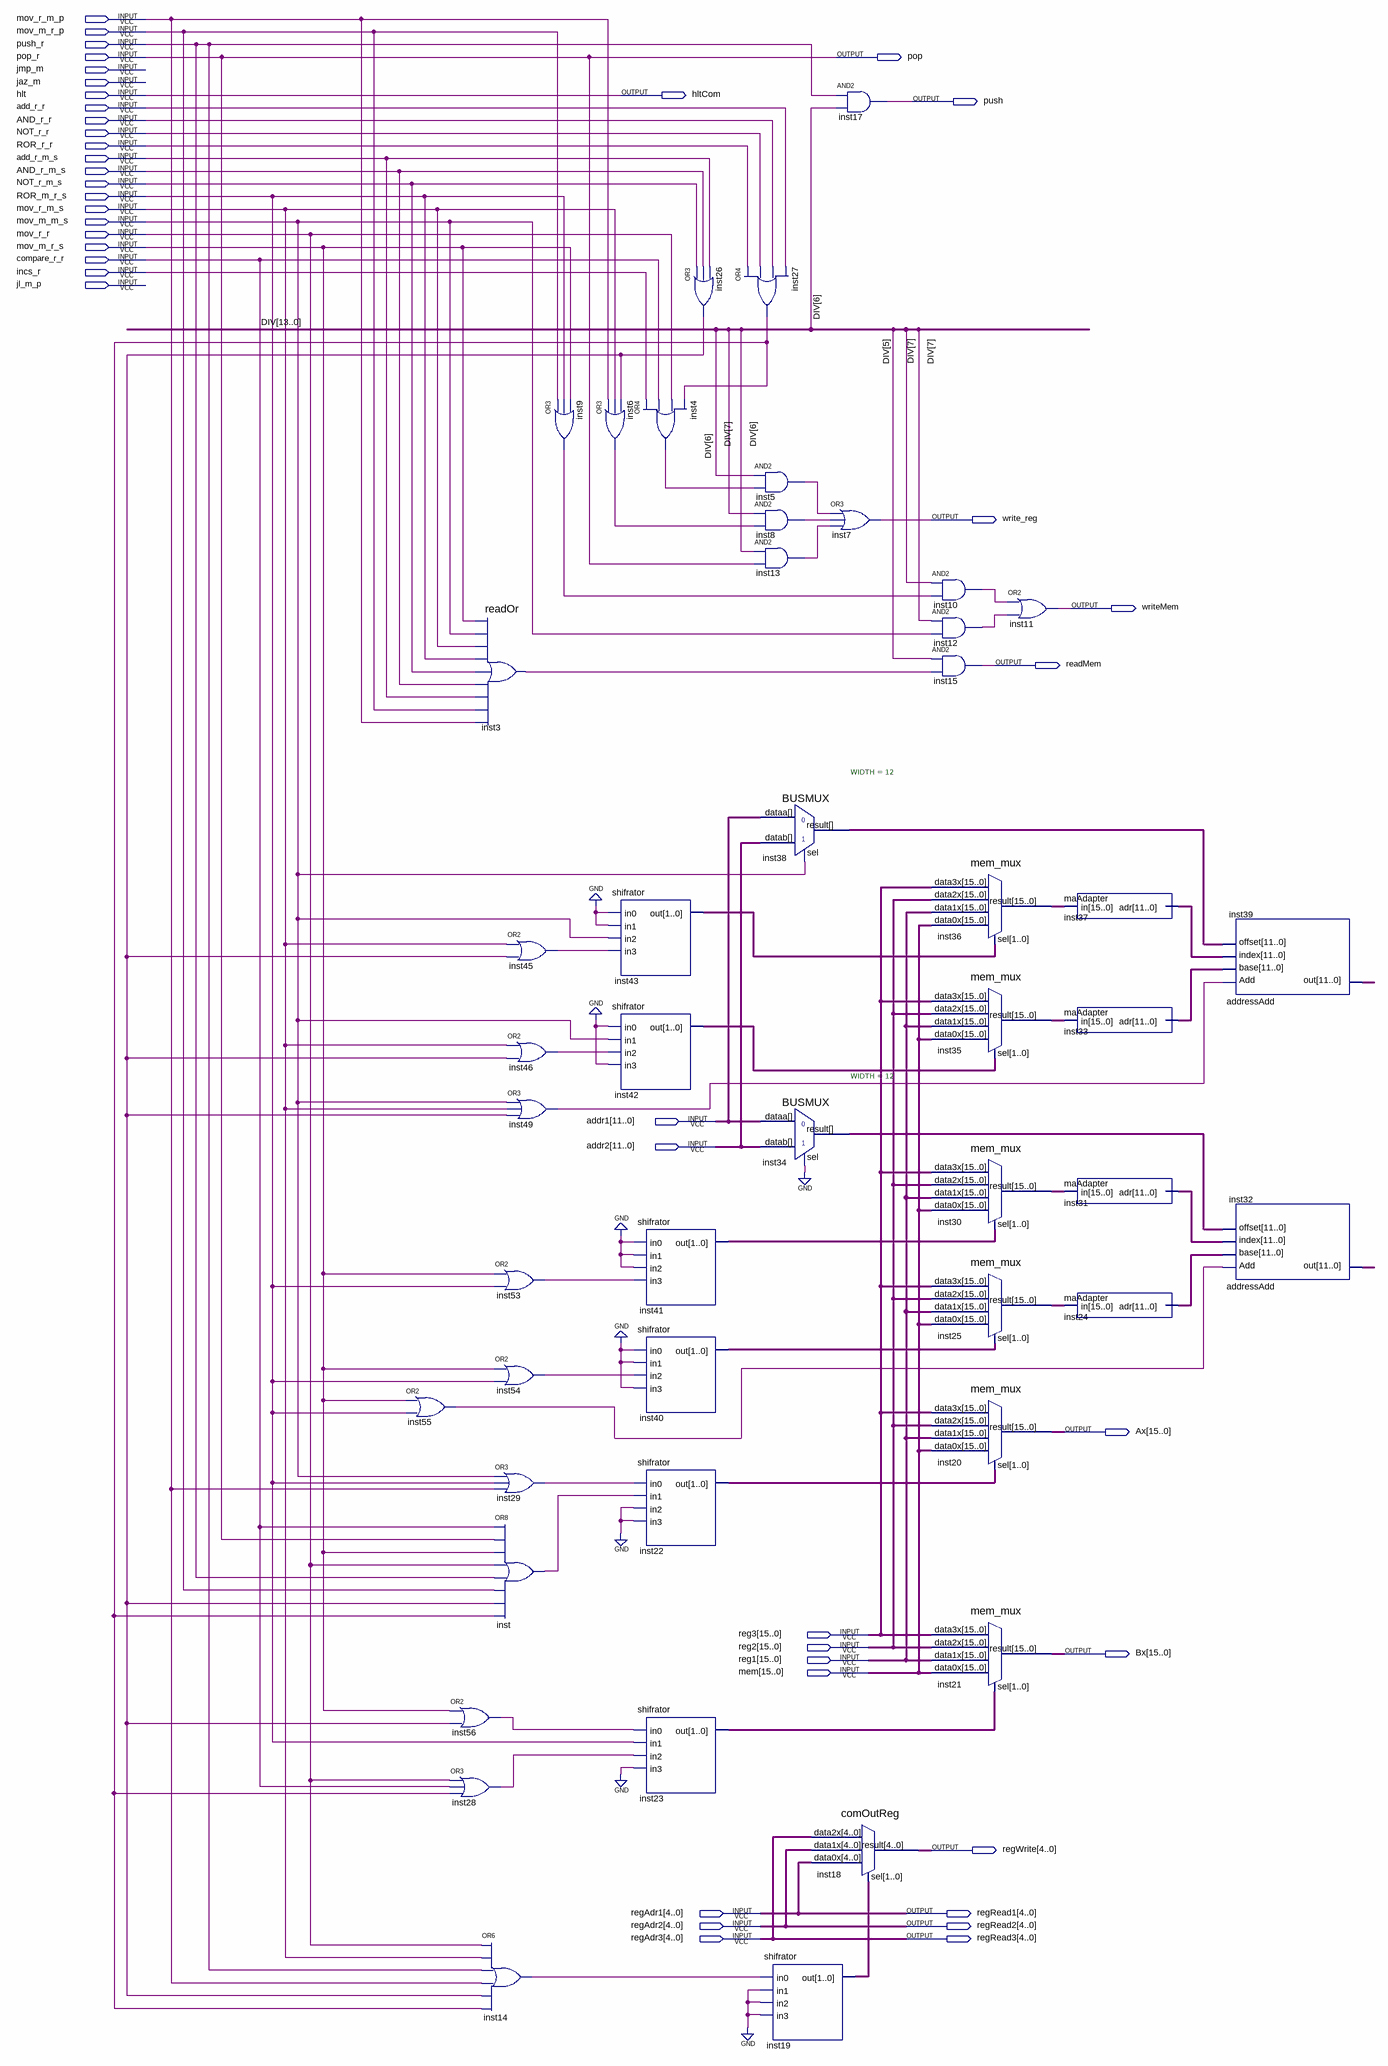
[diagram p0: schematic sheet]
// Quartus schematic CommandX.bdf as structural Verilog: 48 symbols, 43 pins
module CommandX (
  input  mov_r_m_p,
  input  mov_m_r_p,
  input  push_r,
  input  pop_r,
  input  jmp_m,
  input  jaz_m,
  input  hlt,
  input  add_r_r,
  input  AND_r_r,
  input  NOT_r_r,
  input  ROR_r_r,
  input  add_r_m_s,
  input  AND_r_m_s,
  input  NOT_r_m_s,
  input  ROR_m_r_s,
  input  mov_r_m_s,
  input  mov_m_m_s,
  input  mov_r_r,
  input  mov_m_r_s,
  input  compare_r_r,
  input  incs_r,
  input  jl_m_p,
  input  [11:0] addr1,
  input  [11:0] addr2,
  input  [15:0] reg3,
  input  [15:0] reg2,
  input  [15:0] reg1,
  input  [15:0] mem,
  input  [4:0] regAdr1,
  input  [4:0] regAdr2,
  input  [4:0] regAdr3,
  output pop,
  output hltCom,
  output push,
  output write_reg,
  output writeMem,
  output readMem,
  output [15:0] Ax,
  output [15:0] Bx,
  output [4:0] regWrite,
  output [4:0] regRead1,
  output [4:0] regRead2,
  output [4:0] regRead3
);

  wire inst3_result, inst4_out, inst5_out, inst6_out, inst8_out, inst9_out, inst10_out, inst12_out,
       inst13_out, inst14_out, inst26_out, inst27_out, inst28_out, inst29_out, inst45_out, inst46_out,
       inst49_out, inst53_out, inst54_out, inst55_out, inst56_out, inst_out;
  wire [1:0] inst19_out, inst22_out, inst23_out, inst40_out, inst41_out, inst42_out, inst43_out;
  wire [7:5] DIV;
  wire [11:0] inst24_adr, inst31_adr, inst32_out, inst33_adr, inst34_result, inst37_adr, inst38_result,
       inst39_out;
  wire [15:0] inst25_result, inst30_result, inst35_result, inst36_result;

  or inst55 (inst55_out, mov_m_r_s, ROR_m_r_s);
  readOr inst3 (
    .data0(mov_m_r_s), .data1(mov_m_m_s), .data2(mov_r_m_s), .data3(ROR_m_r_s), .data4(NOT_r_m_s),
    .data5(AND_r_m_s), .data6(add_r_m_s), .data7(mov_m_r_p), .data8(mov_r_m_p), .result(inst3_result));
  or inst56 (inst56_out, mov_m_r_s, inst26_out);
  or inst28 (inst28_out, mov_r_r, compare_r_r, inst27_out);
  or inst14 (inst14_out, mov_r_r, mov_r_m_s, push_r, mov_r_m_p, inst26_out, inst27_out);
  or inst45 (inst45_out, mov_r_m_s, inst26_out);
  or inst46 (inst46_out, mov_r_m_s, inst26_out);
  or inst49 (inst49_out, mov_m_m_s, mov_r_m_s, inst26_out);
  or inst53 (inst53_out, mov_m_r_s, ROR_m_r_s);
  or inst54 (inst54_out, mov_m_r_s, ROR_m_r_s);
  or inst29 (inst29_out, mov_m_m_s, ROR_m_r_s, mov_r_m_p);
  or inst (inst_out, compare_r_r, pop_r, mov_m_r_s, mov_r_r, push_r, mov_m_r_p, inst26_out, inst27_out);
  or inst9 (inst9_out, mov_m_r_p, ROR_m_r_s, mov_m_r_s);
  or inst4 (inst4_out, incs_r, compare_r_r, mov_r_r, inst27_out);
  or inst6 (inst6_out, mov_r_m_p, mov_r_m_s, inst26_out);
  shifrator inst43 (.in0(1'b0), .in1(1'b0), .in2(mov_m_m_s), .in3(inst45_out), .out(inst43_out));
  shifrator inst42 (.in0(1'b0), .in1(mov_m_m_s), .in2(inst46_out), .in3(1'b0), .out(inst42_out));
  shifrator inst41 (.in0(1'b0), .in1(1'b0), .in2(1'b0), .in3(inst53_out), .out(inst41_out));
  shifrator inst40 (.in0(1'b0), .in1(1'b0), .in2(inst54_out), .in3(1'b0), .out(inst40_out));
  shifrator inst22 (.in0(inst29_out), .in1(inst_out), .in2(1'b0), .in3(1'b0), .out(inst22_out));
  shifrator inst23 (.in0(inst56_out), .in1(ROR_m_r_s), .in2(inst28_out), .in3(1'b0), .out(inst23_out));
  or inst26 (inst26_out, NOT_r_m_s, AND_r_m_s, add_r_m_s);
  or inst27 (inst27_out, ROR_r_r, NOT_r_r, AND_r_r, add_r_r);
  and inst5 (inst5_out, DIV[6], inst4_out);
  and inst8 (inst8_out, DIV[7], inst6_out);
  and inst13 (inst13_out, DIV[6], pop_r);
  BUSMUX #(.WIDTH(12)) inst38 (.datab(addr2), .sel(mov_m_m_s), .dataa(addr1), .result(inst38_result));
  BUSMUX #(.WIDTH(12)) inst34 (.datab(addr2), .sel(1'b0), .dataa(addr1), .result(inst34_result));
  shifrator inst19 (.in0(inst14_out), .in1(1'b0), .in2(1'b0), .in3(1'b0), .out(inst19_out));
  and inst17 (push, push_r, DIV[6]);
  or inst7 (write_reg, inst5_out, inst8_out, inst13_out);
  comOutReg inst18 (.data2x(regAdr3), .data1x(regAdr2), .data0x(regAdr1), .sel(inst19_out), .result(regWrite));
  and inst10 (inst10_out, DIV[7], inst9_out);
  and inst12 (inst12_out, DIV[7], mov_m_m_s);
  and inst15 (readMem, DIV[5], inst3_result);
  mem_mux inst36 (.data3x(reg3), .data2x(reg2), .data1x(reg1), .data0x(mem), .sel(inst43_out), .result(inst36_result));
  mem_mux inst35 (.data3x(reg3), .data2x(reg2), .data1x(reg1), .data0x(mem), .sel(inst42_out), .result(inst35_result));
  mem_mux inst30 (.data3x(reg3), .data2x(reg2), .data1x(reg1), .data0x(mem), .sel(inst41_out), .result(inst30_result));
  mem_mux inst25 (.data3x(reg3), .data2x(reg2), .data1x(reg1), .data0x(mem), .sel(inst40_out), .result(inst25_result));
  mem_mux inst20 (.data3x(reg3), .data2x(reg2), .data1x(reg1), .data0x(mem), .sel(inst22_out), .result(Ax));
  mem_mux inst21 (.data3x(reg3), .data2x(reg2), .data1x(reg1), .data0x(mem), .sel(inst23_out), .result(Bx));
  or inst11 (writeMem, inst10_out, inst12_out);
  maAdapter inst37 (.in(inst36_result), .adr(inst37_adr));
  maAdapter inst33 (.in(inst35_result), .adr(inst33_adr));
  maAdapter inst31 (.in(inst30_result), .adr(inst31_adr));
  maAdapter inst24 (.in(inst25_result), .adr(inst24_adr));
  addressAdd inst39 (.Add(inst49_out), .base(inst33_adr), .index(inst37_adr), .offset(inst38_result), .out(inst39_out));
  addressAdd inst32 (.Add(inst55_out), .base(inst24_adr), .index(inst31_adr), .offset(inst34_result), .out(inst32_out));

  assign hltCom = hlt;
  assign pop = pop_r;
  assign regRead1 = regAdr1;
  assign regRead2 = regAdr2;
  assign regRead3 = regAdr3;
endmodule
